# Altium schematic sheet Power Management.SchDoc
size A4
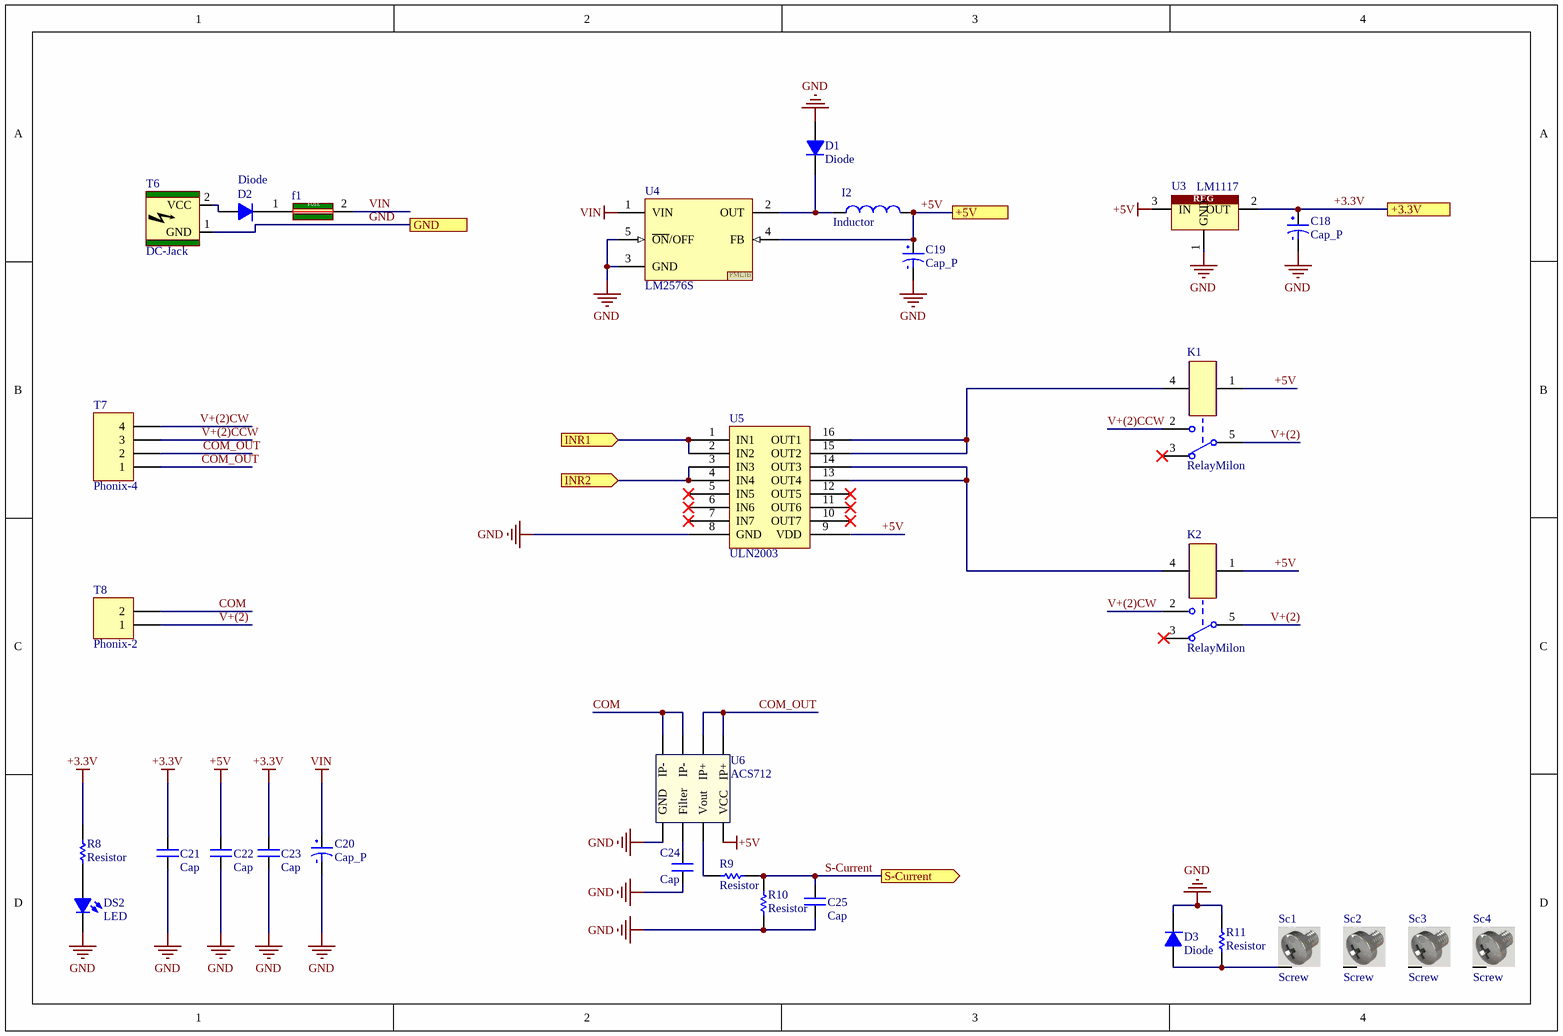
[diagram p0: Power Management.SchDoc]

## Parts
C18  Cap_P  [Cap_4mm]
C19  Cap_P  [Cap_4mm]
C20  Cap_P  [Cap_5mm]
C21  Cap  [Cap0805]
C22  Cap  [Cap0805]
C23  Cap  [Cap0805]
C24  Cap  [Cap0805]
C25  Cap  [Cap0805]
D1  Diode  [Diod-1A-SMD]
D2  Diode  [Diod-1A-SMD]
D3  Diode  [Diod-1A-SMD]
DS2  LED  [Led0805]
f1  Fuse  [1206]  (value not drawn)
I2  Inductor  [Indicator_SMD]
K1  RelayMilon  [Relay_MILONBIG]
K2  RelayMilon  [Relay_MILONBIG]
R8  Resistor  [R0805]
R9  Resistor  [R0805]
R10  Resistor  [R0805]
R11  Resistor  [0603]
Sc1  Screw  [Screw]
Sc2  Screw  [Screw]
Sc3  Screw  [Screw]
Sc4  Screw  [Screw]
T6  DC-Jack  [DC_powerjack]
T7  Phonix-4  [Phonix-4]
T8  Phonix-2  [Phonix-2]
U3  LM1117  [DPACK]
U4  LM2576S  [LM2576S]
U5  ULN2003  [SO16]
U6  ACS712  [SOP8]

## Ports
+3.3V, +5V, GND, INR1 (in), INR2 (in), S-Current (out)

## Nets
+3.3V: C18.2 C21.2 C23.2 R8.1 U3.2(OUT) ; port +3.3V
+5V: C19.2 C22.2 I2.2 K1.1 K2.1 U3.3(IN) U4.4(FB) U5.9(VDD) U6.8(VCC) ; port +5V
GND: C18.1 C19.1 C20.1 C21.1 C22.1 C23.1 C24.1 C25.1 D1.A D3.K DS2.K R10.2 R11.1 T6.1(GND) U3.1(GND) U4.3(GND) U4.5(~{ON}/OFF) U5.8(GND) U6.5(GND) ; port GND
VIN: C20.2 f1.2(OUT) U4.1(VIN)
COM: T8.2 U6.3(IP-) U6.4(IP-)
COM_OUT: T7.1 T7.2 U6.1(IP+) U6.2(IP+)
INR1: U5.1(IN1) U5.2(IN2) ; port INR1
INR2: U5.3(IN3) U5.4(IN4) ; port INR2
S-Current: C25.2 R9.1 R10.1 ; port S-Current
V+(2): K1.5 K2.5 T8.1
V+(2)CCW: K1.2 T7.3
V+(2)CW: K2.2 T7.4
NetC24_2: C24.2 U6.6(Filter)
NetD1_K: D1.K I2.1 U4.2(OUT)
NetD2_A: D2.A T6.2(VCC)
NetD2_K: D2.K f1.1(IN)
NetD3_A: D3.A R11.2 Sc1.S
NetDS2_A: DS2.A R8.2
NetK1_4: K1.4 U5.15(OUT2) U5.16(OUT1)
NetK2_4: K2.4 U5.13(OUT4) U5.14(OUT3)
NetR9_2: R9.2 U6.7(Vout)

Not connected (* = marked no-connect by the designer): K1 3*; K2 3; Sc2 S; Sc3 S; Sc4 S; U5 5(IN5)* 6(IN6)* 7(IN7)* 10(OUT7)* 11(OUT6)* 12(OUT5)*

## Notes on the sheet
- Title
- Size:
- Data:
- CompanyName:
- A4
- Number:
- Time:
- Revision:
- Engineer:
- File:
- (in symbol Fuse) FUSE
- (in symbol LM1117) REG
- (in symbol LM2576S) PMLIB

## Library data of the parts
C18-C20 = Cap_P: Polarity
C21-C25 = Cap: Surface mount Capacitor
I2 = Inductor: Indicator
Sc1-Sc4 = Screw: Screw 3mm
T7 = Phonix-4: Connector
T8 = Phonix-2: Connector
U3 = LM1117: Regulator
U4 = LM2576S: Regulator
U5 = ULN2003: High-voltage, high-current Darlington arrays
U6 = ACS712: Hall effect Current Sensor